# Altium schematic sheet Endstops.SchDoc: Endstops
size Letter; SheetNumber: 6; SheetTotal: 11
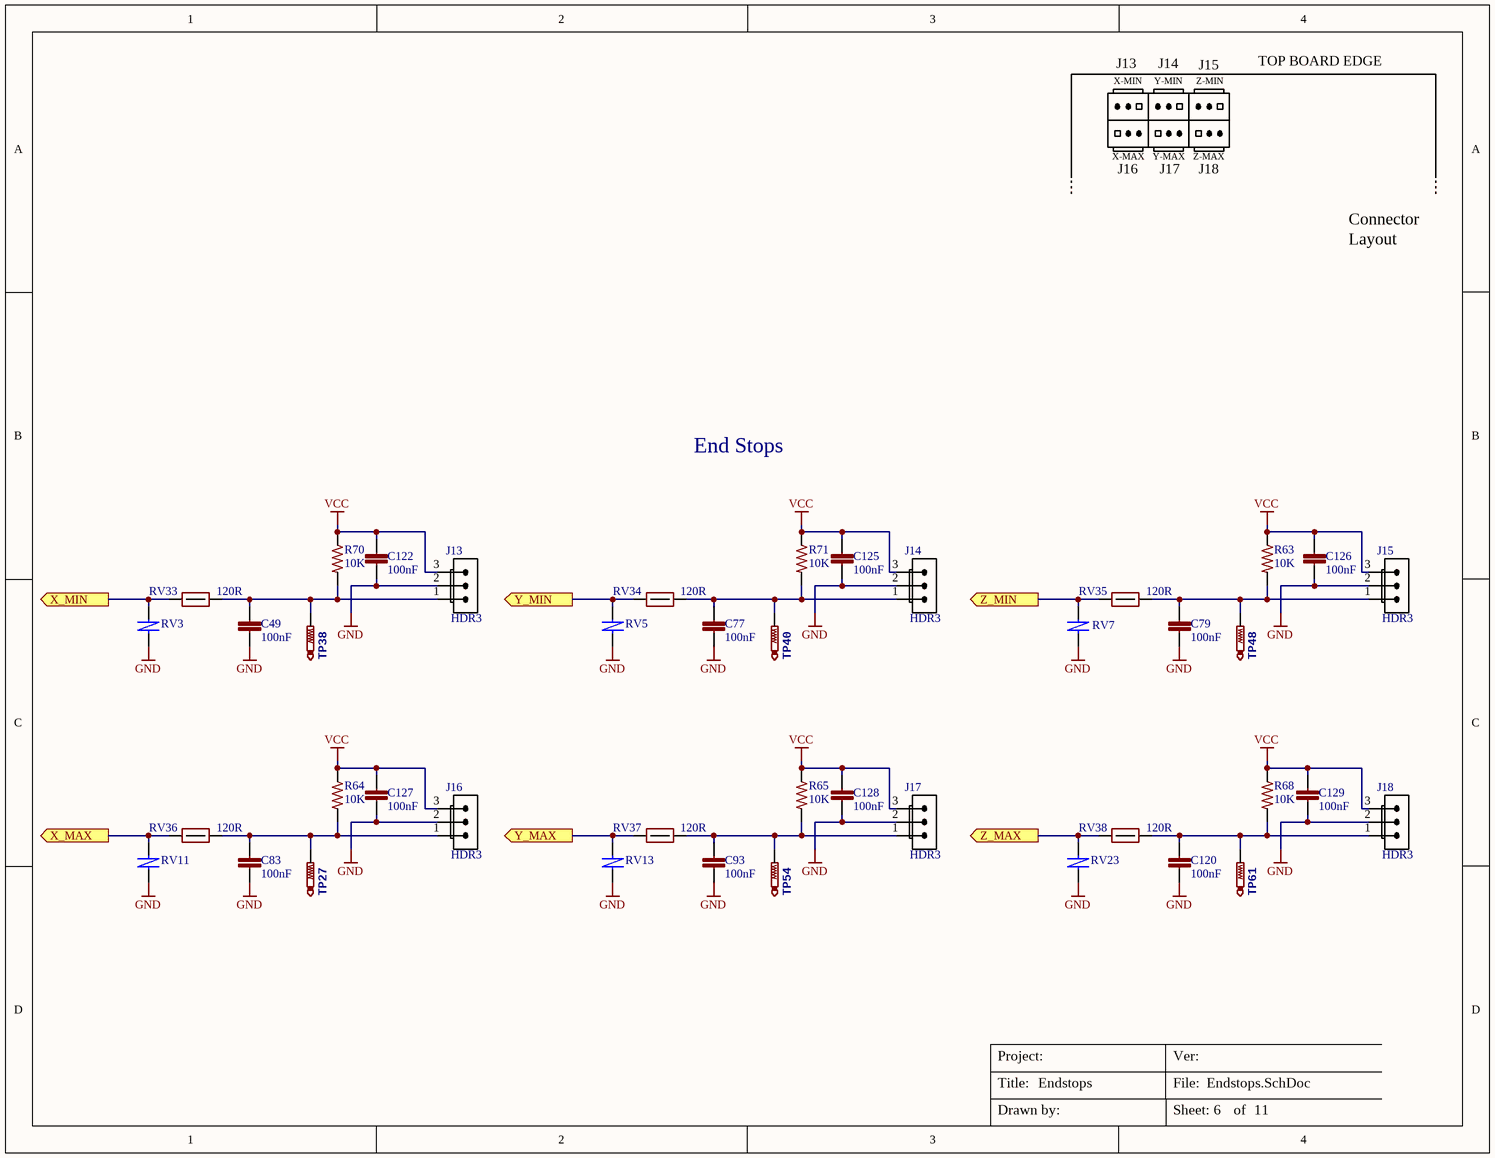
[diagram p0: Endstops.SchDoc]

## Parts
C49  100nF  [C0402]
C77  100nF  [C0402]
C79  100nF  [C0402]
C83  100nF  [C0402]
C93  100nF  [C0402]
C120  100nF  [C0402]
C122  100nF  [C0402]
C125  100nF  [C0402]
C126  100nF  [C0402]
C127  100nF  [C0402]
C128  100nF  [C0402]
C129  100nF  [C0402]
J13  value HDR3  [70543-03]  (hidden comment: Molex 70543-03)
J14  value HDR3  [70543-03]  (hidden comment: Molex 70543-03)
J15  value HDR3  [70543-03]  (hidden comment: Molex 70543-03)
J16  value HDR3  [70543-03]  (hidden comment: Molex 70543-03)
J17  value HDR3  [70543-03]  (hidden comment: Molex 70543-03)
J18  value HDR3  [70543-03]  (hidden comment: Molex 70543-03)
R63  10K  [R0402]
R64  10K  [R0402]
R65  10K  [R0402]
R68  10K  [R0402]
R70  10K  [R0402]
R71  10K  [R0402]
RV3  VRS0402SR55R101N  [C0402]  (value not drawn)
RV5  VRS0402SR55R101N  [C0402]  (value not drawn)
RV7  VRS0402SR55R101N  [C0402]  (value not drawn)
RV11  VRS0402SR55R101N  [C0402]  (value not drawn)
RV13  VRS0402SR55R101N  [C0402]  (value not drawn)
RV23  VRS0402SR55R101N  [C0402]  (value not drawn)
RV33  120R  [R0402]
RV34  120R  [R0402]
RV35  120R  [R0402]
RV36  120R  [R0402]
RV37  120R  [R0402]
RV38  120R  [R0402]
TP27  TestPoint  [TP1-27]  (value not drawn)  (no BOM)
TP38  TestPoint  [TP1-27]  (value not drawn)  (no BOM)
TP40  TestPoint  [TP1-27]  (value not drawn)  (no BOM)
TP48  TestPoint  [TP1-27]  (value not drawn)  (no BOM)
TP54  TestPoint  [TP1-27]  (value not drawn)  (no BOM)
TP61  TestPoint  [TP1-27]  (value not drawn)  (no BOM)

## Ports
X_MAX, X_MIN, Y_MAX, Y_MIN, Z_MAX, Z_MIN

## Nets
GND: C49.2 C77.2 C79.2 C83.2 C93.2 C120.2 C122.2 C125.2 C126.2 C127.2 C128.2 C129.2 J13.2(S) J14.2(S) J15.2(S) J16.2(S) J17.2(S) J18.2(S) RV3.1 RV5.1 RV7.1 RV11.1 RV13.1 RV23.1
VCC: C122.1 C125.1 C126.1 C127.1 C128.1 C129.1 J13.3(S) J14.3(S) J15.3(S) J16.3(S) J17.3(S) J18.3(S) R63.1 R64.1 R65.1 R68.1 R70.1 R71.1
X_MAX: RV11.2 RV36.1 ; port X_MAX
X_MIN: RV3.2 RV33.1 ; port X_MIN
Y_MAX: RV13.2 RV37.1 ; port Y_MAX
Y_MIN: RV5.2 RV34.1 ; port Y_MIN
Z_MAX: RV23.2 RV38.1 ; port Z_MAX
Z_MIN: RV7.2 RV35.1 ; port Z_MIN
NetC49_1: C49.1 J13.1(S) R70.2 RV33.2 TP38.TP
NetC77_1: C77.1 J14.1(S) R71.2 RV34.2 TP40.TP
NetC79_1: C79.1 J15.1(S) R63.2 RV35.2 TP48.TP
NetC83_1: C83.1 J16.1(S) R64.2 RV36.2 TP27.TP
NetC93_1: C93.1 J17.1(S) R65.2 RV37.2 TP54.TP
NetC120_1: C120.1 J18.1(S) R68.2 RV38.2 TP61.TP

## Notes on the sheet
- X-MIN
- J13
- Y-MIN
- J14
- Z-MIN
- J15
- TOP BOARD EDGE
- X-MAX
- Y-MAX
- Z-MAX
- J16
- J17
- J18
- Connector
- Layout
- End Stops
- Title:
- Project:
- File:
- Ver:
- Drawn by:
- Sheet:
- of

## Library data of the parts
C49 C77 C79 C83 C93 C120 C122 C125-C129 = GRM155R71C104KA88D: CAP CER 0402 100nF 16V 10% X7R; Manufacturer: Murata; Part Description: 0.10µF ±10% 16V Ceramic Capacitor X7R 0402 (1005 Metric); EE_SPEC: 100nF 16V X7R 0402; Tolerance: +/- 10%; VALUE: 100nF; MANUFACTURER #: GRM155R71C104KA88D; DISTRIBUTOR #: 490-3261-2-ND; DISTRIBUTOR: Digi-Key; PART: 100nF
J13-J18 = CONN 3POS VERT 0.1" SHRD LOCKING: 3 Positions Header, Shrouded Connector 0.100" (2.54mm) Through Hole Gold; MANUFACTURER #: 0705430002; PART: 3 Pin Conn VERT; TOLERANCE: -NA-; MANUFACTURER: Molex; DISTRIBUTOR #: WM4801-ND; DISTRIBUTOR: Digi-Key; PART DESCRIPTION: 3 Positions Header, Shrouded Connector 0.100" (2.54mm) Through Hole Gold; EE_SPEC: -NA-
R63-R65 R68 R70 R71 = RC0402FR-0710KP: RES SMD 10K OHM 1% 1/16W 0402; MANUFACTURER: Yageo; PART: 10k 1% 0402; PART DESCRIPTION: 10k Ohm ±1% 0.063W, 1/16W Chip Resistor 0402 (1005 Metric) Moisture Resistant Thick Film; EE_SPEC: 10k 1% 0402 1/16W; VALUE: 10K; MANUFACTURER #: RC0402FR-0710KP; DISTRIBUTOR #: YAG1249TR-ND; DISTRIBUTOR: Digi-Key; TOLERANCE: 1%
RV3 RV5 RV7 RV11 RV13 RV23 = VRS0402SR55R101N: Multi-Layer Varistor; Manufacturer: Yageo; Part Description: VARISTOR 12V 10A 0402; Value: 12V; EE_SPEC: 5.5Vdc 12Vvar 60pF; Tolerance: NA; DISTRIBUTOR #: 311-1516-2-ND; DISTRIBUTOR: Digi-Key; MANUFACTURER #: VRS0402SR55R101N; PART: 12V
RV33-RV38 = FERRITE 120R 1A 0402: FERRITE BEAD 120 OHM 0402 1LN; MANUFACTURER: Taiyo Yuden; MANUFACTURER #: BKP1005HS121-T; VALUE: 120Rfb; TOLERANCE: -NA-; EE_SPEC: 1A; DISTRIBUTOR #: 587-1921-2-ND; DISTRIBUTOR: Digikey; PART: FERRITE 120R 1A 0402; PART DESCRIPTION: FERRITE BEAD 120 OHM 0402 1LN
TP27 TP38 TP40 TP48 TP54 TP61 = TestPoint: Test Point